# Altium schematic sheet MCU.SchDoc
size A4; SheetNumber: 5; SheetTotal: 9
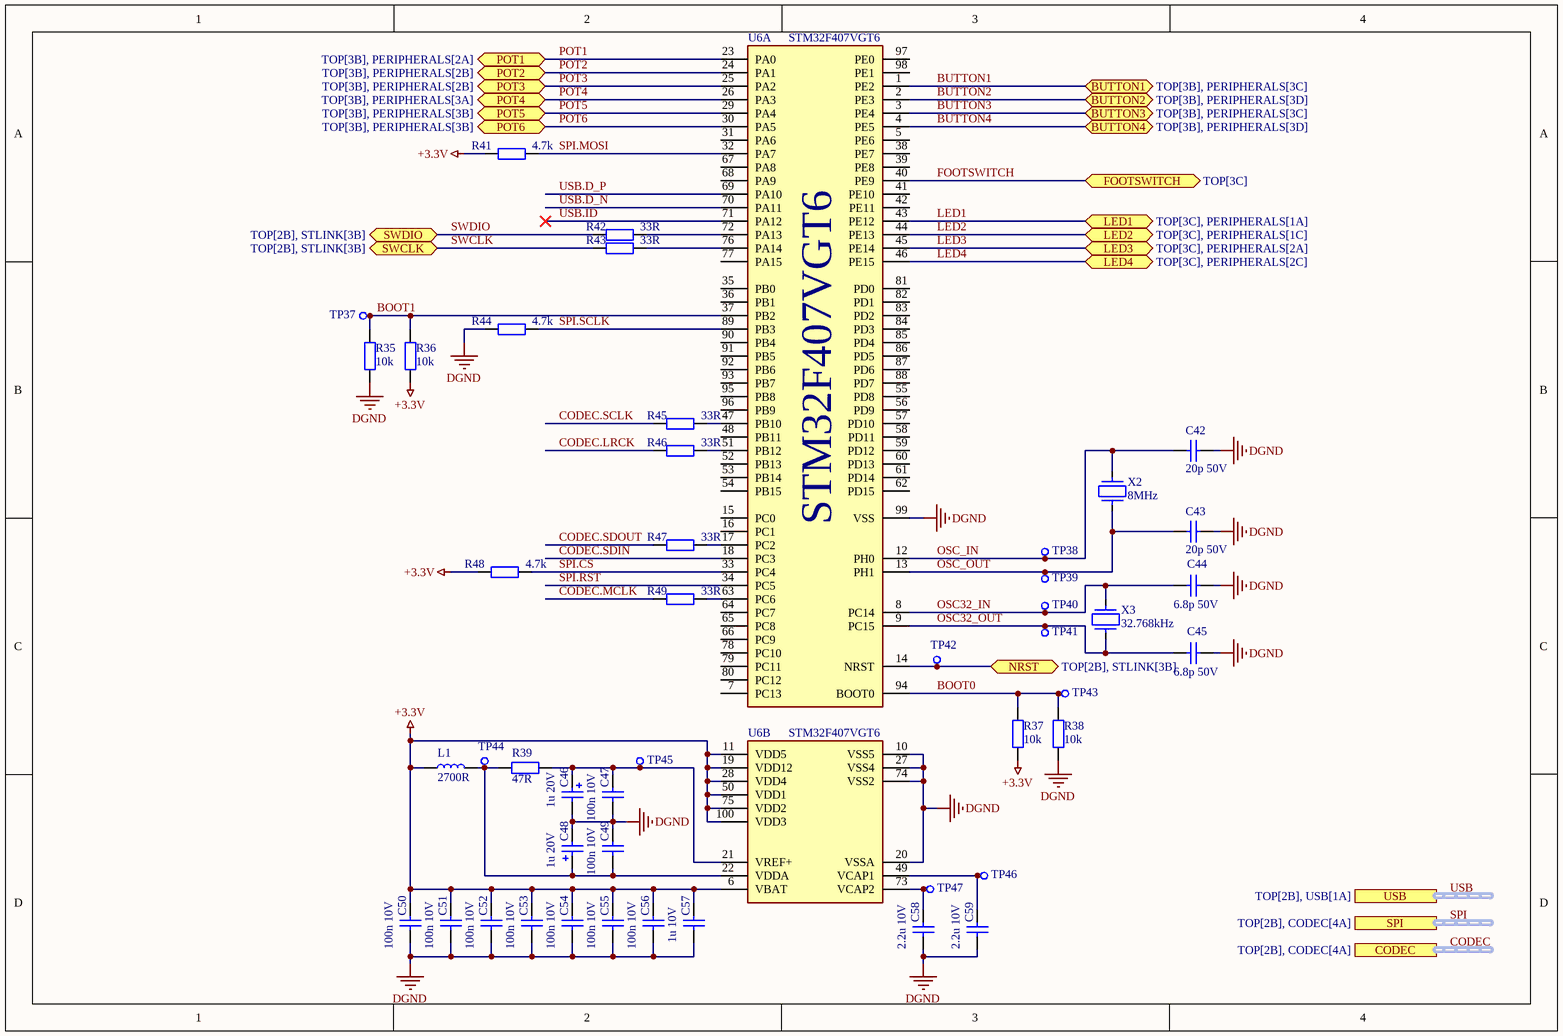
[diagram p0: MCU.SchDoc]

## Parts
C42  20p 50V  [CAPACITOR 0805]
C43  20p 50V  [CAPACITOR 0805]
C44  6.8p 50V  [CAPACITOR 0805]
C45  6.8p 50V  [CAPACITOR 0805]
C46  1u 20V  [CAPACITOR 1206]
C47  100n 10V  [CAPACITOR 0805]
C48  1u 20V  [CAPACITOR 1206]
C49  100n 10V  [CAPACITOR 0805]
C50  100n 10V  [CAPACITOR 0805]
C51  100n 10V  [CAPACITOR 0805]
C52  100n 10V  [CAPACITOR 0805]
C53  100n 10V  [CAPACITOR 0805]
C54  100n 10V  [CAPACITOR 0805]
C55  100n 10V  [CAPACITOR 0805]
C56  100n 10V  [CAPACITOR 0805]
C57  1u 10V  [CAPACITOR 0805]
C58  2.2u 10V  [CAPACITOR 0805]
C59  2.2u 10V  [CAPACITOR 0805]
L1  2700R  [FERRITE 0805]
R35  10k  [RESISTOR 0805]
R36  10k  [RESISTOR 0805]
R37  10k  [RESISTOR 0805]
R38  10k  [RESISTOR 0805]
R39  47R  [RESISTOR 0805]
R41  4.7k  [RESISTOR 0805]
R42  33R  [RESISTOR 0805]
R43  33R  [RESISTOR 0805]
R44  4.7k  [RESISTOR 0805]
R45  33R  [RESISTOR 0805]
R46  33R  [RESISTOR 0805]
R47  33R  [RESISTOR 0805]
R48  4.7k  [RESISTOR 0805]
R49  33R  [RESISTOR 0805]
TP37  1mm  [TEST POINT 1MM]  (value not drawn)
TP38  1mm  [TEST POINT 1MM]  (value not drawn)
TP39  1mm  [TEST POINT 1MM]  (value not drawn)
TP40  1mm  [TEST POINT 1MM]  (value not drawn)
TP41  1mm  [TEST POINT 1MM]  (value not drawn)
TP42  1mm  [TEST POINT 1MM]  (value not drawn)
TP43  1mm  [TEST POINT 1MM]  (value not drawn)
TP44  1mm  [TEST POINT 1MM]  (value not drawn)
TP45  1mm  [TEST POINT 1MM]  (value not drawn)
TP46  1mm  [TEST POINT 1MM]  (value not drawn)
TP47  1mm  [TEST POINT 1MM]  (value not drawn)
U6  STM32F407VGT6  [LQFP-100]  (parts A,B of 2)
X2  8MHz  [OSCILLATOR 8MHZ SMD]
X3  32.768kHz  [OSCILLATOR 32.768KHZ SMD]

## Ports
BUTTON1 (bidir, see TOP[3B], PERIPHERALS[3C]), BUTTON2 (bidir, see TOP[3B], PERIPHERALS[3D]), BUTTON3 (bidir, see TOP[3B], PERIPHERALS[3C]), BUTTON4 (bidir, see TOP[3B], PERIPHERALS[3D]), CODEC (harness I2S, see TOP[2B], CODEC[4A]), FOOTSWITCH (bidir, see TOP[3C]), LED1 (bidir, see TOP[3C], PERIPHERALS[1A]), LED2 (bidir, see TOP[3C], PERIPHERALS[1C]), LED3 (bidir, see TOP[3C], PERIPHERALS[2A]), LED4 (bidir, see TOP[3C], PERIPHERALS[2C]), NRST (bidir, see TOP[2B], STLINK[3B]), POT1 (bidir, see TOP[3B], PERIPHERALS[2A]), POT2 (bidir, see TOP[3B], PERIPHERALS[2B]), POT3 (bidir, see TOP[3B], PERIPHERALS[2B]), POT4 (bidir, see TOP[3B], PERIPHERALS[3A]), POT5 (bidir, see TOP[3B], PERIPHERALS[3B]), POT6 (bidir, see TOP[3B], PERIPHERALS[3B]), SPI (harness SPI, see TOP[2B], CODEC[4A]), SWCLK (bidir, see TOP[2B], STLINK[3B]), SWDIO (bidir, see TOP[2B], STLINK[3B]), USB (harness USB, see TOP[2B], USB[1A])

## Nets
+3.3V: C50.2 C51.2 C52.2 C53.2 C54.2 C55.2 C56.2 C57.2 L1.1 R36.1 R37.1 R41.1 R48.1 U6.6(VBAT) U6.11(VDD5) U6.19(VDD12) U6.28(VDD4) U6.50(VDD1) U6.75(VDD2) U6.100(VDD3)
DGND: C42.2 C43.2 C44.2 C45.2 C46.2 C47.1 C48.2 C49.2 C50.1 C51.1 C52.1 C53.1 C54.1 C55.1 C56.1 C57.1 C58.1 C59.1 R35.1 R38.1 R44.1 U6.10(VSS5) U6.20(VSSA) U6.27(VSS4) U6.74(VSS2) U6.99(VSS)
BOOT0: R37.2 R38.2 TP43.1 U6.94(BOOT0)
BOOT1: R35.2 R36.2 TP37.1 U6.37(PB2)
BUTTON1: U6.1(PE2) ; port BUTTON1
BUTTON2: U6.2(PE3) ; port BUTTON2
BUTTON3: U6.3(PE4) ; port BUTTON3
BUTTON4: U6.4(PE5) ; port BUTTON4
CODEC.LRCK: R46.1
CODEC.MCLK: R49.1
CODEC.SCLK: R45.1
CODEC.SDIN: U6.18(PC3)
CODEC.SDOUT: R47.1
FOOTSWITCH: U6.40(PE9) ; port FOOTSWITCH
LED1: U6.43(PE12) ; port LED1
LED2: U6.44(PE13) ; port LED2
LED3: U6.45(PE14) ; port LED3
LED4: U6.46(PE15) ; port LED4
NRST: TP42.1 U6.14(NRST) ; port NRST
OSC32_IN: C44.1 TP40.1 U6.8(PC14) X3.1
OSC32_OUT: C45.1 TP41.1 U6.9(PC15) X3.4
OSC_IN: C42.1 TP38.1 U6.12(PH0) X2.2
OSC_OUT: C43.1 TP39.1 U6.13(PH1) X2.1
POT1: U6.23(PA0) ; port POT1
POT2: U6.24(PA1) ; port POT2
POT3: U6.25(PA2) ; port POT3
POT4: U6.26(PA3) ; port POT4
POT5: U6.29(PA4) ; port POT5
POT6: U6.30(PA5) ; port POT6
SPI.~{CS}: R48.2 U6.33(PC4)
SPI.MOSI: R41.2 U6.32(PA7)
SPI.~{RST}: U6.34(PC5)
SPI.SCLK: R44.2 U6.89(PB3)
SWCLK: R43.1 ; port SWCLK
SWDIO: R42.1 ; port SWDIO
USB.D_N: U6.70(PA11)
USB.D_P: U6.69(PA10)
USB.ID: U6.71(PA12)
NetC46_1: C46.1 C47.2 R39.2 TP45.1 U6.21(VREF+)
NetC48_1: C48.1 C49.1 L1.2 R39.1 TP44.1 U6.22(VDDA)
NetC58_2: C58.2 TP47.1 U6.73(VCAP2)
NetC59_2: C59.2 TP46.1 U6.49(VCAP1)
NetR42_2: R42.2 U6.72(PA13)
NetR43_2: R43.2 U6.76(PA14)
NetR45_2: R45.2 U6.47(PB10)
NetR46_2: R46.2 U6.51(PB12)
NetR47_2: R47.2 U6.17(PC2)
NetR49_2: R49.2 U6.63(PC6)

Not connected (* = marked no-connect by the designer): U6 5(PE6) 7(PC13) 15(PC0) 16(PC1) 31(PA6) 35(PB0) 36(PB1) 38(PE7) 39(PE8) 41(PE10) 42(PE11) 48(PB11) 52(PB13) 53(PB14) 54(PB15) 55(PD8) 56(PD9) 57(PD10) 58(PD11) 59(PD12) 60(PD13) 61(PD14) 62(PD15) 64(PC7) 65(PC8) 66(PC9) 67(PA8) 68(PA9) 77(PA15) 78(PC10) 79(PC11) 80(PC12) 81(PD0) 82(PD1) 83(PD2) 84(PD3) 85(PD4) 86(PD5) 87(PD6) 88(PD7) 90(PB4) 91(PB5) 92(PB6) 93(PB7) 95(PB8) 96(PB9) 97(PE0) 98(PE1)

## Buses and harness runs
harness CODEC = port CODEC
harness SPI = port SPI
harness USB = port USB

## Library data of the parts
C42 C43 = Capacitor 20p 50V ±5% NP0 0805: Capacitor: ceramic; MLCC; 20pF; 50V; C0G (NP0); ±5%; SMD; 0805; Manufacturer: KYOCERA AVX; Manufacturer Part Number: 08055A200JAT2A; ComponentLink1Description: Datasheet; ComponentLink1URL: https://www.tme.eu/Document/bbf9b851c2f67970461c4f5edb477604/C0GNP0-Dielectric.pdf; Footprint: Capacitor 0805; Price 10pcs [$]: 0.0910; Supplier: TME
C44 C45 = Capacitor 6.8p 50V ±0.25pF NP0 0805: Capacitor: ceramic; MLCC; 6.8pF; 50V; C0G (NP0); ±0.25pF; SMD; 0805; Manufacturer: YAGEO; Manufacturer Part Number: CC0805CRNPO96R8; ComponentLink1Description: Datasheet; ComponentLink1URL: https://www.tme.eu/Document/04f8372e9ba78fa4699feb147e4488d1/UPY-GP_NP0_16V-to-50V_18.pdf; Footprint: Capacitor 0805; Price 10pcs [$]: 0.0314; Supplier: TME
C46 C48 = Capacitor 1u 20V 20% Tantalum 1206: Capacitor: tantalum; 1uF; 20VDC; SMD; A; 1206; ±10%; -55÷125°C; T491; Manufacturer: KEMET; Manufacturer Part Number: T491A105K020AT; ComponentLink1Description: Datasheet; ComponentLink1URL: https://www.tme.eu/Document/7d1742c16e813d90cbbda272068592d8/Datasheet-T491A105K020AT.pdf; Footprint: Capacitor 1206; Price 10pcs [$]: 0.2; Supplier: TME
C47 C49-C56 = Capacitor 100n 100V 10% X7R 0805: Capacitor: ceramic; MLCC; 100nF; 100V; X7R; ±10%; SMD; 0805; Manufacturer: YAGEO; Manufacturer Part Number: CC0805KKX7R0BB104; ComponentLink1Description: Datasheet; ComponentLink1URL: https://www.tme.eu/Document/fbb9415081fcefba62c0f8bbf5b21210/UPY-GPHC_X7R_6.3V-to-50V_20.pdf; Footprint: Capacitor 0805; Price 10pcs [$]: 0.0770; Supplier: TME
C57 = Capacitor 1u 10V 10% X7R 0805: Capacitor: ceramic; MLCC; 1uF; 10V; X7R; ±10%; SMD; 0805; Manufacturer: YAGEO; Manufacturer Part Number: CC0805KKX7R6BB105; ComponentLink1Description: Datasheet; ComponentLink1URL: https://www.tme.eu/Document/fbb9415081fcefba62c0f8bbf5b21210/UPY-GPHC_X7R_6.3V-to-50V_20.pdf; Footprint: Capacitor 0805; Price 10pcs [$]: 0.0770; Supplier: TME
C58 C59 = Capacitor 2.2u 10V 10% X7R 0805: Multilayer Ceramic Capacitors MLCC - SMD/SMT 0603 16VDC 1uF 10% X7R; Manufacturer: YAGEO; Manufacturer Part Number: CC0805KKX7R6BB225; ComponentLink1Description: Datasheet; ComponentLink1URL: https://www.tme.eu/Document/fbb9415081fcefba62c0f8bbf5b21210/UPY-GPHC_X7R_6.3V-to-50V_20.pdf; Footprint: Capacitor 0805; Price 10pcs [$]: 0.0770; Supplier: TME
L1 = Inductor Ferrite Bead 2700Ω 0805 0.2A: Ferrite: bead; 2700Ω; SMD; 200mA; 0805; -55÷125°C; Manufacturer: MURATA; Manufacturer Part Number: BLM21BD272SN1L; ComponentLink1Description: Datasheet; ComponentLink1URL: https://www.tme.eu/Document/c9c44cce174b2958868ee1fe8b54450c/BLM21B222SPT-DTE.pdf; Price 10pcs [$]: 0.11; Supplier: TME
R35-R38 = Resistor 10k 1% 1/8W 0805: Resistor: thick film; SMD; 0805; 10kΩ; 0.125W; ±1%; -55÷155°C; Manufacturer: Yageo; Manufacturer Part Number: RC0805FR-0710K; ComponentLink1Description: Datasheet; ComponentLink1URL: https://www.tme.eu/Document/7b8fed8c112f8a94930279c22c957f7f/rc0805yageo.pdf; Price 10pcs [$]: 0.016; Supplier: TME
R39 = Resistor 47R 1% 1/8W 0805: Resistor: thick film; SMD; 0805; 47Ω; 0.125W; ±1%; -55÷155°C; Manufacturer: Yageo; Manufacturer Part Number: RC0805FR-0747R; ComponentLink1Description: Datasheet; ComponentLink1URL: https://www.tme.eu/Document/7b8fed8c112f8a94930279c22c957f7f/rc0805yageo.pdf; Footprint: Resistor 0805; Price 10pcs [$]: 0.023; Supplier: TME
R41 R44 R48 = Resistor 4.7k 1% 1/8W 0805: Resistor: thick film; SMD; 0805; 4.7kΩ; 0.125W; ±1%; -55÷155°C; Manufacturer: Yageo; Manufacturer Part Number: RC0805FR-074K7; ComponentLink1Description: Datasheet; ComponentLink1URL: https://www.tme.eu/Document/7b8fed8c112f8a94930279c22c957f7f/rc0805yageo.pdf; Price 10pcs [$]: 0.02250; Supplier: TME
R42 R43 R45-R47 R49 = Resistor 33R 1% 1/8W 0805: Resistor: thick film; SMD; 0805; 33Ω; 0.125W; ±1%; -55÷155°C; Manufacturer: Yageo; Manufacturer Part Number: RC0805FR-0733R; ComponentLink1Description: Datasheet; ComponentLink1URL: https://www.tme.eu/Document/7b8fed8c112f8a94930279c22c957f7f/rc0805yageo.pdf; Footprint: Resistor 0805; Price 10pcs [$]: 0.023; Supplier: TME
TP37-TP47 = Mechanical Test Point 1mm: Tesp Point 1mm; ComponentLink1Description: Datasheet; ComponentLink1URL: -; Manufacturer: -; Manufacturer Part Number: -; Footprint: -; Price 10pcs [$]: -; Supplier: -
U6 = IC MCU ARM M4 STM32F407VGT6: IC: ARM microcontroller; 168MHz; LQFP100; 1.8÷3.6VDC; Manufacturer: STMicroelectronics; ComponentLink1Description: Datasheet; ComponentLink1URL: https://www.tme.eu/Document/fe050b8f135d502e6bbd22755be2aa50/stm32f405XX_F407XX.pdf; Manufacturer Part Number: STM32F407VGT6; Price 10pcs [$]: 15.02; Supplier: TME
X2 = Crystal 8MHz 20p SMD: Crystals CRYSTAL 8.0000MHZ 20PF SMD; Manufacturer: ABRACON; Manufacturer Part Number: ABLS-8.000MHZ-20-B-3-H-T; ComponentLink1Description: Datasheet; ComponentLink1URL: https://www.mouser.pl/datasheet/2/3/abls-1664338.pdf; Price 10pcs [$]: 0.129; Supplier: Mouser
X3 = Crystal 32.768kHz 8x3.2x2.38mm SMD: Resonator: watch; 32.768kHz; ±20ppm; SMD; 8x3.2x2.38mm; Manufacturer: EPSON; Manufacturer Part Number: MC306 32.768000KHZ 12.5PF; ComponentLink1Description: Datasheet; ComponentLink1URL: https://www.tme.eu/Document/8408670dbfdc08cb99f8b22d7675923e/MC-306_en.pdf; Price 10pcs [$]: 0.768; Supplier: TME